# Altium schematic sheet Przekaźnik_A4_Landscape_.SchDoc
size A4; Author: Michał Berdzik; CompanyName: AGH
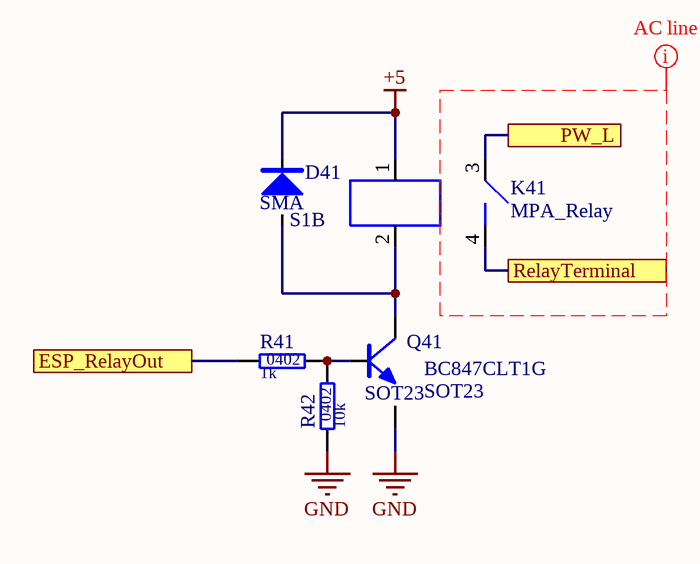
[diagram p0: Przekaźnik_A4_Landscape_.SchDoc]

## Parts
D41  value S1B  SCH_Footprint: SMA  [SMA_DO-214AC]
K41  MPA_Relay  [MPA_Relay]
Q41  value BC847CLT1G  SCH_Footprint: SOT23  [SOT23_TO236_SC59]  (hidden comment: BC847C)
R41  value 1k  SCH_Footprint: 0402  [R_0402_1005]  (hidden comment: Resistor)
R42  value 10k  SCH_Footprint: 0402  [R_0402_1005]  (hidden comment: Resistor)

## Ports
ESP_RelayOut, PW_L, RelayTerminal

## Nets
+5: D41.1 K41.1
GND: Q41.2(E) R42.1
ESP_RelayOut: R41.1 ; port ESP_RelayOut
PW_L: K41.3 ; port PW_L
RelayTerminal: K41.4 ; port RelayTerminal
NetD41_2: D41.2 K41.2 Q41.3(C)
NetQ41_1: Q41.1(B) R41.2 R42.2

## Layout directives
rule Width Constraint [Pref Width = 40mil    Min Width = 30mil    Max Width = 50mil]; rule Clearance Constraint [Clearance = 0.4mm]: (no net found under the mark)

## Notes on the sheet
- Nazwa uczelni: <Company Name>
- Nazwisko konstruktora:

## Library data of the parts
D41 = D_S1B_1A_100V_SMA: Manufacturer: Vishay/General Semiconductor; Voltage: 100V; Current: 1A; Part Number: D_S1B_1A_100V_SMA; Manufacturer Part Number: S1B; Supplier 1: TME; Supplier 2: RS Components; Supplier 3: Farnell; Supplier 4: Mouser; Supplier Part Number 4: 821-S1B; Supplier 5: Digi-Key; Supplier Part Number 5: S1B/51GI
Q41 = QNP_BC847C_45V_0A1: Manufacturer: ON Semiconductor; Type: NPN; Voltage: 45V; Current: 0A1; Part Number: QNP_BC847C_45V_0A1; HelpURL: https://assets.nexperia.com/documents/data-sheet/BC847_SER.pdf; Manufacturer Part Number: BC847CLT1G; Supplier 1: TME; Supplier Part Number 1: BC847CLT1G; Supplier 2: RS Components; Supplier 3: Farnell; Supplier 4: Mouser; Supplier 5: Digi-Key; Supplier Part Number 5: BC847CLT1GOSCT-ND
R41 = R_1k_0402: Manufacturer: Yageo; Manufacturer Part Number: RC0402FR-071K; Voltage: 50V; Power: 63mW; Tolerance: 1%; Part Number: R_1k_0402; HelpURL: http://www.tme.eu/pl/Document/1a2bc76e2be68b3b1670068306778ce6/rc0402yageo.pdf; Supplier 1: TME; Supplier Part Number 1: RC0402FR-071K; Supplier 2: RS Components; Supplier 3: Farnell; Supplier 4: Mouser; Supplier 5: Digi-Key
R42 = R_10k_0402_1: Manufacturer: Yageo; Manufacturer Part Number: RC0402FR-0710KL; Voltage: 50V; Power: 63mW; Tolerance: 1%; Part Number: R_10k_0402_1; HelpURL: http://www.tme.eu/pl/Document/1a2bc76e2be68b3b1670068306778ce6/rc0402yageo.pdf; Supplier 1: TME; Supplier Part Number 1: RC0402FR-0710K; Supplier 2: RS Components; Supplier 3: Farnell; Supplier 4: Mouser; Supplier 5: Digi-Key
K41 = MPA_Relay: Value: *; SupplierPartNumber: *; Supplier: *